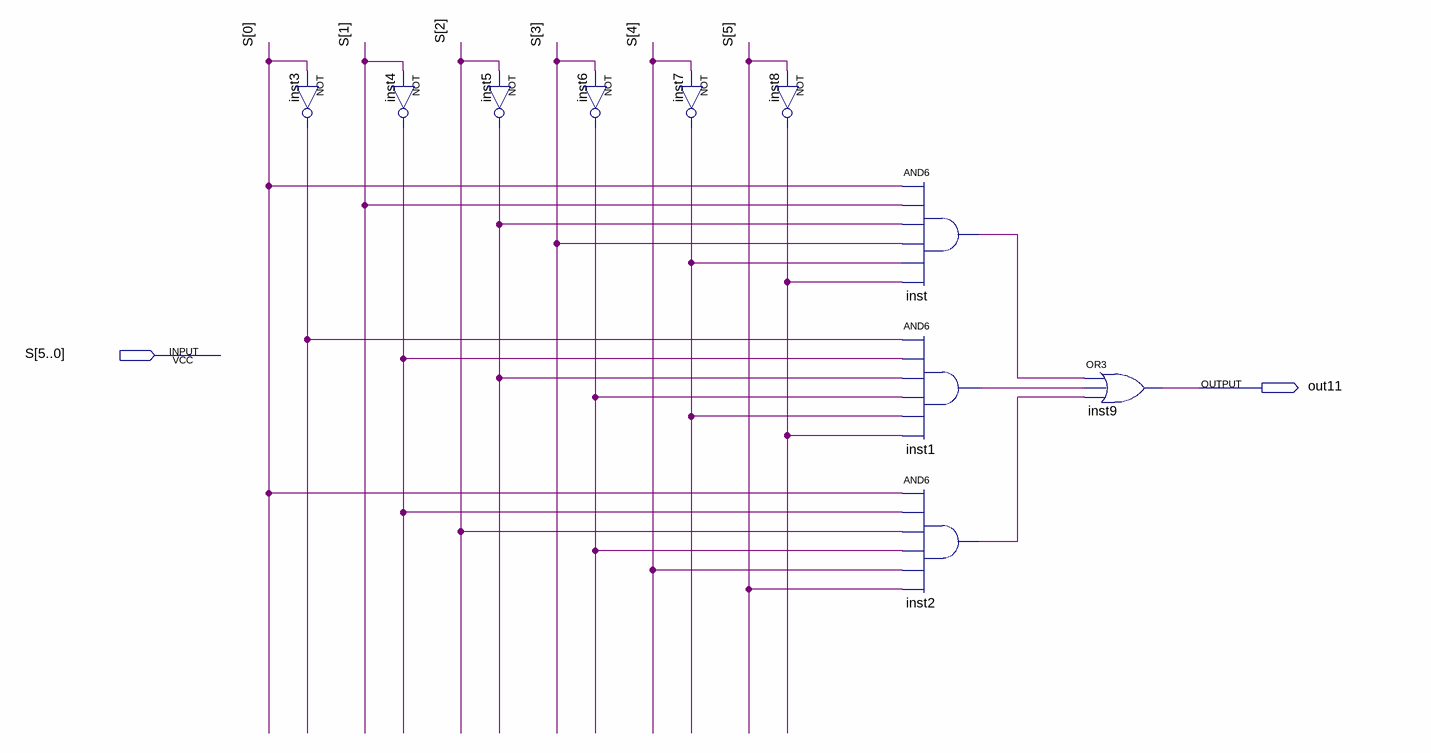
[diagram p0: schematic sheet]
// Quartus schematic division11check.bdf as structural Verilog: 10 symbols, 2 pins
module division11check (
  input  [5:0] S,
  output out11
);

  wire inst1_out, inst2_out, inst3_out, inst4_out, inst5_out, inst6_out, inst7_out, inst8_out, inst_out;

  not inst3 (inst3_out, S[0]);
  not inst4 (inst4_out, S[1]);
  not inst5 (inst5_out, S[2]);
  not inst6 (inst6_out, S[3]);
  not inst7 (inst7_out, S[4]);
  not inst8 (inst8_out, S[5]);
  and inst (inst_out, S[0], S[1], inst5_out, S[3], inst7_out, inst8_out);
  and inst1 (inst1_out, inst3_out, inst4_out, inst5_out, inst6_out, inst7_out, inst8_out);
  and inst2 (inst2_out, S[0], inst4_out, S[2], inst6_out, S[4], S[5]);
  or inst9 (out11, inst_out, inst1_out, inst2_out);
endmodule
